# EAGLE design lm239d (EAGLE 6.5.0)
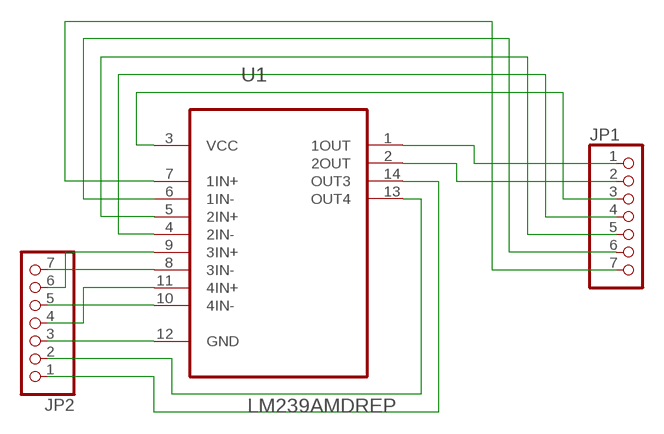
[diagram p0: schematic, sheet 1]

## Parts
JP1  PINHD-1X7  [1X07]
JP2  PINHD-1X7  [1X07]
U1  LM239AMDREP  [SOIC127P600X175-14N]

## Nets
N$1: JP1.1 U1.1(1OUT)
N$2: JP1.2 U1.2(2OUT)
N$3: JP1.3 U1.3(VCC)
N$4: JP1.4 U1.4(2IN-)
N$5: JP1.5 U1.5(2IN+)
N$6: JP1.6 U1.6(1IN-)
N$7: JP1.7 U1.7(1IN+)
N$8: JP2.7 U1.8(3IN-)
N$9: JP2.6 U1.9(3IN+)
N$10: JP2.4 U1.11(4IN+)
N$11: JP2.5 U1.10(4IN-)
N$12: JP2.3 U1.12(GND)
N$13: JP2.2 U1.13(OUT4)
N$14: JP2.1 U1.14(OUT3)

## Library data of the parts
JP1 JP2 = pinhead:PINHD-1X7: PIN HEADER
U1 = Texas Instruments_By_element14_Batch_1:LM239AMDREP: QUAD DIFFERENTIAL COMPARATORS; MPN: LM239AMDREP; OC_FARNELL: -; OC_NEWARK: 79R8092; PACKAGE: SOIC-14; SUPPLIER: Texas Instruments

## Board
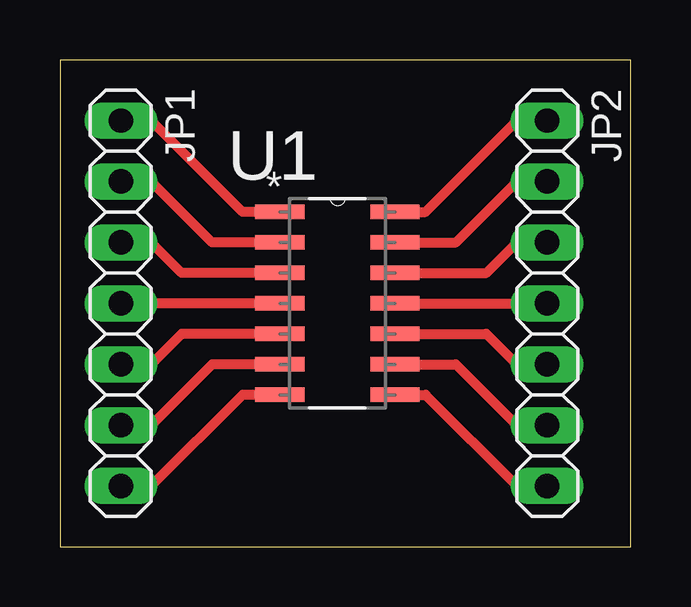
[diagram p1: board, top side]

Size 23.8 x 20.31 mm. Coordinates in mm from the lower left corner, seen from the top.
Outline: 0,0 23.8,0 23.8,20.31 0,20.31 0,0
Copper layers (1*16): Top 0.035mm / dielectric 1.5mm / Bottom 0.035mm
Design rules "default": minimum track width 10mil, minimum drill 24mil, track to track 8mil, track to pad 8mil, pad to pad 8mil, via to via 8mil, smd to smd 8mil, copper to edge 40mil, drill to drill 8mil, minimum pad ring 10mil, minimum via ring 8mil, stop-mask expansion 4mil, vias tented up to drill 0mil, thermal gap 10mil

### Footprints (pad centres in the part's own frame; a part is rotated, then mirrored left to right if it is on the bottom)
1X07 = drill 1.016 long: 1 -7.62,0; 2 -5.08,0; 3 -2.54,0; 4 0,0; 5 2.54,0; 6 5.08,0; 7 7.62,0
SOIC127P600X175-14N = smd 2.057 x 0.61: 1 -4.801,7.62; 2 -4.801,6.35; 3 -4.801,5.08; 4 -4.801,3.81; 5 -4.801,2.54; 6 -4.801,1.27; 7 -4.801,0; 8 0,0; 9 0,1.27; 10 0,2.54; 11 0,3.81; 12 0,5.08; 13 0,6.35; 14 0,7.62

### Placement (x,y rotation side)
JP1  2.54,10.16 270 top
JP2  20.32,10.16 270 top
U1  13.97,6.35 0 top

### Tracks (layer width: path | path; a pad name or v marks a point on that pad's centre or on a via)
N$1
  Top 0.406: U1.1 7.62,13.97 3.81,17.78 JP1.1
N$2
  Top 0.406: U1.2 6.35,12.7 3.81,15.24 JP1.2
N$3
  Top 0.406: U1.3 5.08,11.43 3.81,12.7 JP1.3
N$4
  Top 0.406: U1.4 JP1.4
N$5
  Top 0.406: U1.5 5.08,8.89 3.81,7.62 JP1.5
N$6
  Top 0.406: U1.6 6.35,7.62 3.81,5.08 JP1.6
N$7
  Top 0.406: U1.7 7.62,6.35 3.81,2.54 JP1.7
N$8
  Top 0.406: U1.8 15.24,6.35 19.05,2.54 JP2.7
N$9
  Top 0.406: U1.9 16.51,7.62 19.05,5.08 JP2.6
N$10
  Top 0.406: U1.11 JP2.4
N$11
  Top 0.406: U1.10 17.78,8.89 19.05,7.62 JP2.5
N$12
  Top 0.406: U1.12 17.78,11.43 19.05,12.7 JP2.3
N$13
  Top 0.406: U1.13 16.51,12.7 19.05,15.24 JP2.2
N$14
  Top 0.406: U1.14 15.24,13.97 19.05,17.78 JP2.1